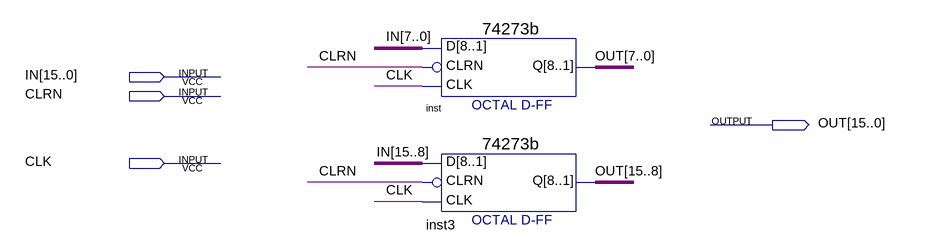
[diagram p0: schematic sheet]
// Quartus schematic Latch_Register_16bit_Clr.bdf as structural Verilog: 2 symbols, 4 pins
module Latch_Register_16bit_Clr (
  input  [15:0] IN,
  input  CLRN,
  input  CLK,
  output [15:0] OUT
);

  \74273b  inst (.CLK(CLK), .D(IN[7:0]), .CLRN(CLRN), .Q(OUT[7:0]));
  \74273b  inst3 (.CLK(CLK), .D(IN[15:8]), .CLRN(CLRN), .Q(OUT[15:8]));
endmodule
